# EAGLE schematic basic_ftdi (EAGLE 6.1)
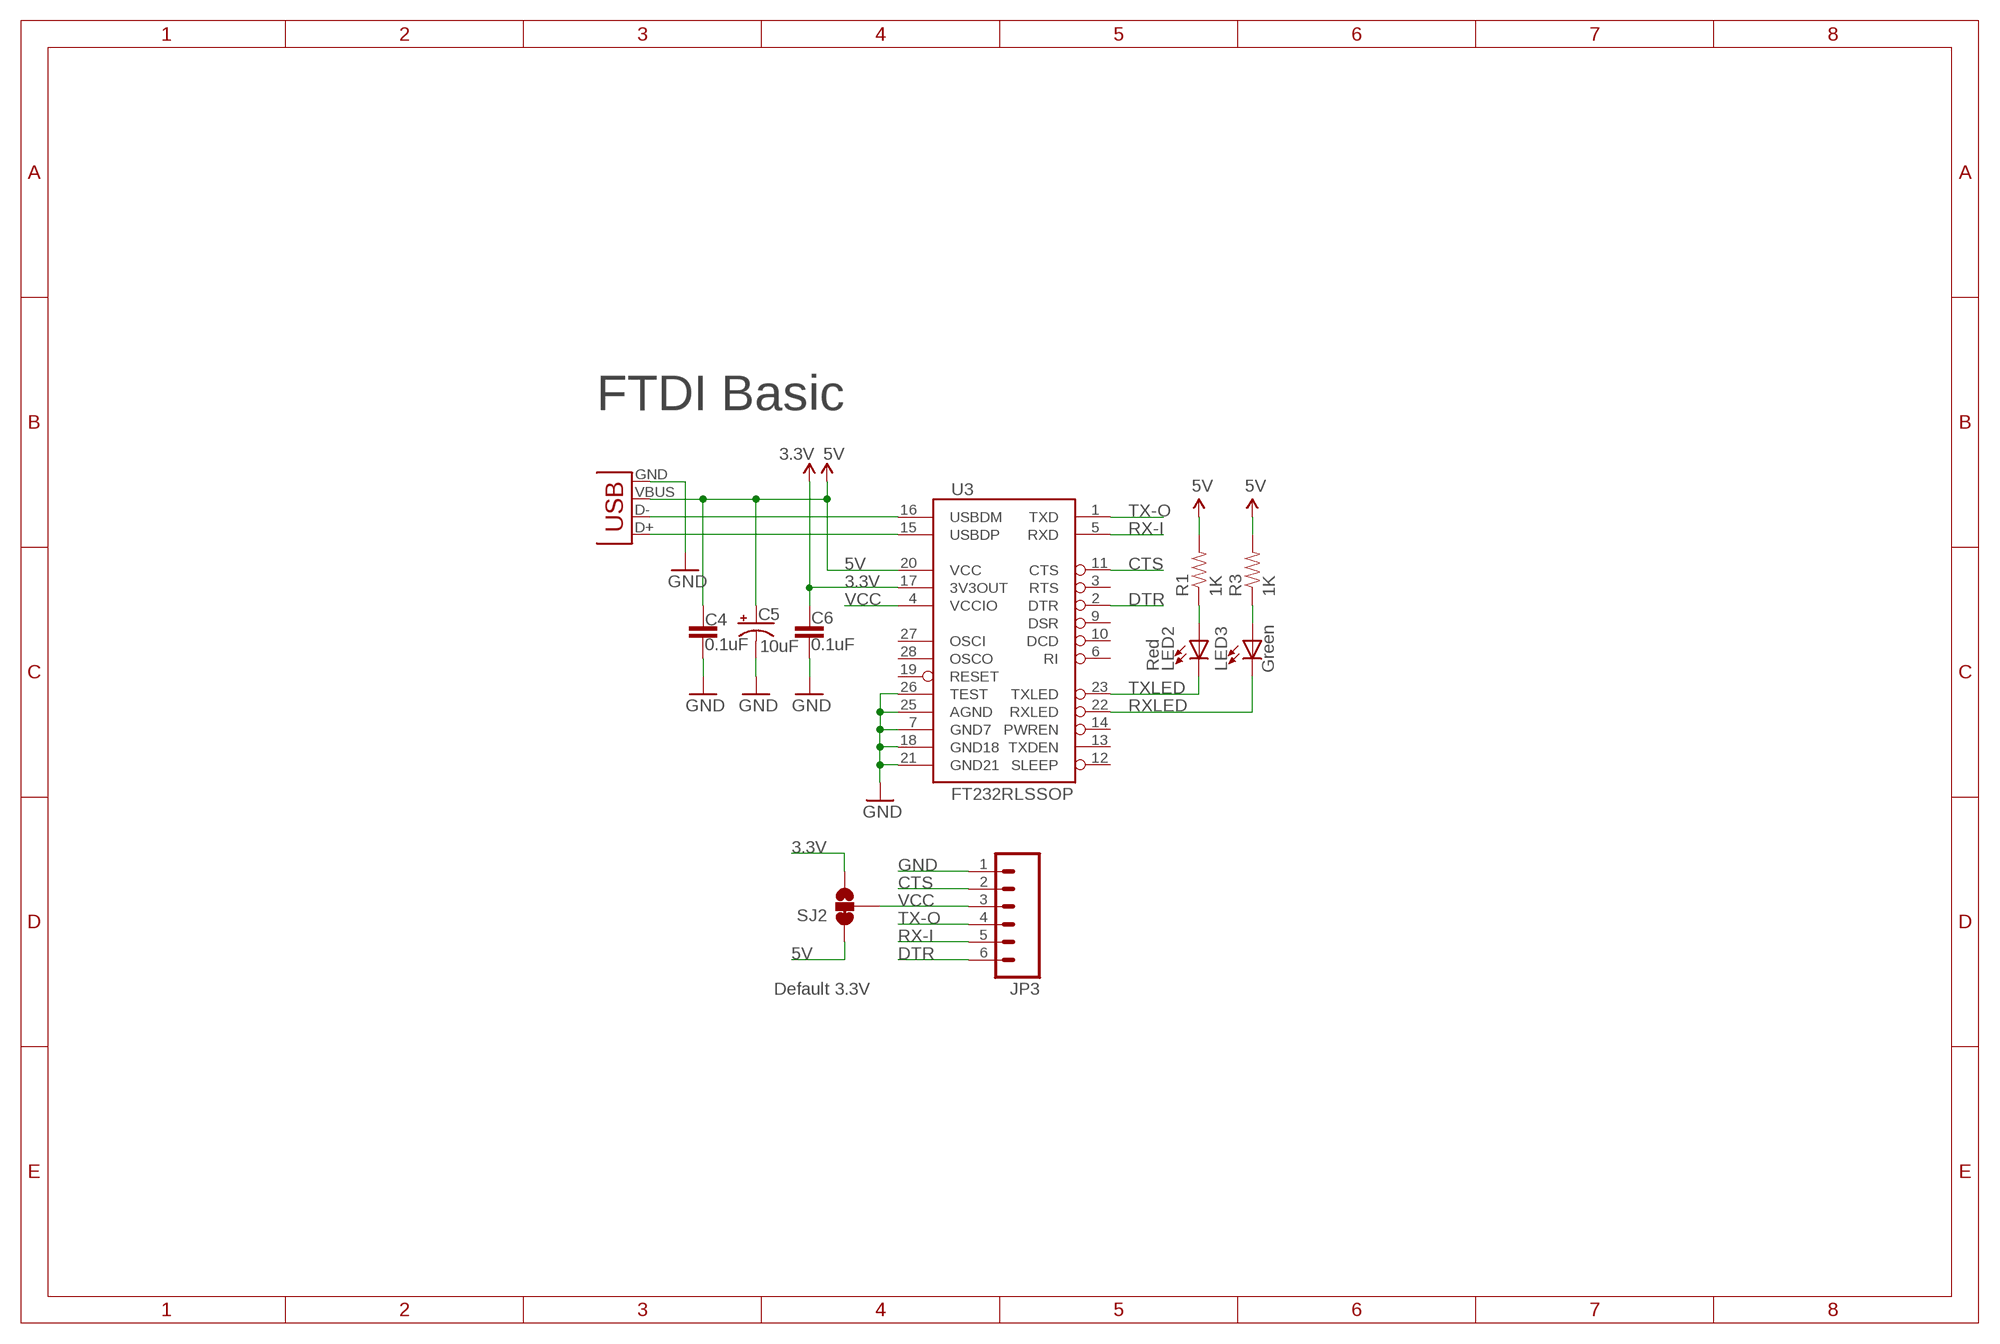
[diagram p0: schematic, sheet 1]

## Parts
C4  0.1uF  CAP0402-CAP  [0402-CAP]
C5  10uF  CAP_POL1206  [EIA3216]
C6  0.1uF  CAP0402-CAP  [0402-CAP]
JP3  M06SIP  [1X06]
LED2  Red  LED0603  [LED-0603]
LED3  Green  LED0603  [LED-0603]
R1  1K  RESISTOR0402-RES  [0402-RES]
R3  1K  RESISTOR0402-RES  [0402-RES]
SJ2  SOLDERJUMPER_2WAYS  [SJ_3]
U3  FT232RLSSOP  [SSOP28DB]
X2  USB-SMD-NS  [USB-MINIB-NOSTOP]

## Nets
3.3V [power]: C6.1 SJ2.3 U3.17(3V3OUT)
5V: C4.1 C5.A(+) R1.2 R3.2 SJ2.1 U3.20(VCC) X2.VBUS
CTS: JP3.2 U3.11(CTS)
DTR: JP3.6 U3.2(DTR)
GND [power]: C4.2 C5.C(-) C6.2 JP3.1 U3.7(GND7) U3.18(GND18) U3.21(GND21) U3.25(AGND) U3.26(TEST) X2.GND
N$3: LED2.A R1.1
N$4: LED3.A R3.1
RX-I: JP3.5 U3.5(RXD)
RXLED: LED3.C U3.22(RXLED)
TX-O: JP3.4 U3.1(TXD)
TXLED: LED2.C U3.23(TXLED)
USB_D+: U3.15(USBDP) X2.D+
USB_D-: U3.16(USBDM) X2.D-
VCC: JP3.3 SJ2.2 U3.4(VCCIO)
Unconnected: U3.3(RTS) U3.6(RI) U3.9(DSR) U3.10(DCD) U3.12(SLEEP) U3.13(TXDEN) U3.14(PWREN) U3.19(RESET) U3.27(OSCI) U3.28(OSCO)

## Notes on the sheet
- FTDI Basic
- Default 3.3V

## Library data of the parts
C4 C6 = SparkFun:CAP: Capacitor Standard 0603 ceramic capacitor, and 0.1" leaded capacitor.
C5 = SparkFun:CAP_POL: Capacitor Polarized These are standard SMD and PTH capacitors. Normally 10uF, 47uF, and 100uF in electrolytic and tantalum varieties. Always verify the external diameter of the through hole cap, it varies with capacity, voltage, and manufacturer. The EIA devices should be standard.
JP3 = SparkFun:M06: Header 6 Standard 6-pin 0.1" header. Use with straight break away headers (SKU : PRT-00116), right angle break away headers (PRT-00553), swiss pins (PRT-00743), machine pins (PRT-00117), and female headers (PRT-00115). Molex polarized connector foot print use with SKU : PRT-08094 with associated crimp pins and housings. NOTES ON THE VARIANTS LOCK and LOCK_LONGPADS... This footprint was designed to help hold the alignment of a through-hole component (i.e. 6-pin header) while soldering it into place. You may notice that each hole has been shifted either up or down by 0.005 of an inch from it's more standard position (which is a perfectly straight line). This slight alteration caused the pins (the squares in the middle) to touch the edges of the holes. Because they are alternating, it causes a "brace" to hold the component in place. 0.005 has proven to be the perfect amount of "off-center" position when using our standard breakaway headers. Although looks a little odd when you look at the bare footprint, once you have a header in there, the alteration is very hard to notice. Also, if you push a header all the way into place, it is covered up entirely on the bottom side. This idea of altering the position of holes to aid alignment will be further integrated into the Sparkfun Library for other footprints. It can help hold any component with 3 or more connection pins.
LED2 LED3 = SparkFun:LED: LEDs Standard schematic elements and footprints for 5mm, 3mm, 1206, and 0603 sized LEDs. 5mm - Spark Fun Electronics SKU : COM-00529 (and others)
R1 R3 = SparkFun:RESISTOR: Resistor Basic schematic elements and footprints for 0603, 1206, and PTH resistors.
SJ2 = SparkFun:SOLDERJUMPER_2WAY: Solder Jumper 2 way solder jumper
U3 = SparkFun:FT232RL: USB UART FT232RL 4th Generation USB UART (USB <-> Serial) Controller. Spark Fun Electronics SKU : COM-00650
X2 = SparkFun:USB: USB Connectors USB-B-PTH is fully proven SKU : PRT-00139 USB-miniB is fully proven SKU : PRT-00587 USB-A-PCB is untested. USB-A-H is throughly reviewed, but untested. Spark Fun Electronics SKU : PRT-00437 USB-B-SMT is throughly reviewed, but untested. Needs silkscreen touching up. USB-A-S has not been used/tested USB-MB-H has not been used/tested

## Net classes
0 default: width 0.203 mm
1 power: width 0.254 mm